# Altium schematic sheet master.SchDoc
size A4
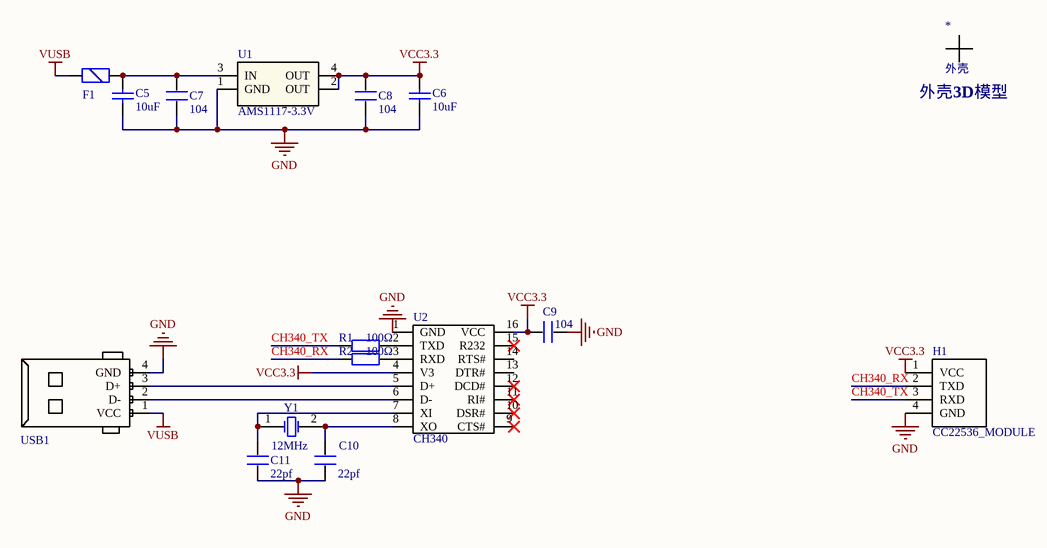
[diagram p0: master.SchDoc]

## Parts
*  外壳  [接收端外壳]
C5  10uF  [0805_C]
C6  10uF  [0805_C]
C7  104  [0603_C]
C8  104  [0603_C]
C9  104  [0603_C]
C10  22pf  [0603_C]
C11  22pf  [0603_C]
F1  F1  [Fuse1210]  (value not drawn)
H1  CC22536_MODULE  [HDR1X4]
R1  100Ω  [0603_R]
R2  100Ω  [0603_R]
U1  AMS1117-3.3V  [AMS1117_S0T89]
U2  CH340  [SOP16]
USB1  USB  [USB-211]  (value not drawn)
Y1  12MHz  [XTAL-49/S_N]

## Nets
GND: C5.1 C6.1 C7.2 C8.2 C9.1 C10.2 C11.1 H1.4(GND) U1.1(GND) U2.1(GND) USB1.4(GND)
VCC3.3: C6.2 C8.1 C9.2 H1.1(VCC) U1.2(OUT) U1.4(OUT) U2.4(V3) U2.16(VCC)
VUSB: F1.2 USB1.1(VCC)
CH340_RX: H1.2(TXD) R2.2
CH340_TX: H1.3(RXD) R1.2
NetC5_2: C5.2 C7.1 F1.1 U1.3(IN)
NetC10_1: C10.1 U2.8(XO) Y1.2(OSC2)
NetC11_2: C11.2 U2.7(XI) Y1.1(OSC1)
NetR1_1: R1.1 U2.2(TXD)
NetR2_1: R2.1 U2.3(RXD)
NetU2_5: U2.5(D+) USB1.3(D+)
NetU2_6: U2.6(D-) USB1.2(D-)

Not connected (* = marked no-connect by the designer): U2 9(CTS#)* 10(DSR#)* 11(RI#)* 12(DCD#)* 13(DTR#) 14(RTS#) 15(R232)*

## Notes on the sheet
- (near *) 外壳3D模型

## Library data of the parts
C5 C6 = 0805 2.2uF (225) 20% 50V: 贴片电容; ComponentLink1Description: 供应商链接; ComponentLink1URL: http://www.szlcsc.com/product/details_50225.html; Package: 0805; Supplier: LC; SuppliersPartNumber: C49217
C7-C11 = C
F1 = Fuse
R1 R2 = 0603 1.1KΩ (1101) 1%: 贴片电阻; ComponentLink1Description: 供应商链接; ComponentLink1URL: http://www.szlcsc.com/product/details_23491.html; Package: 0603; Supplier: LC; SuppliersPartNumber: C22764
U1 = AMS1117
USB1 = USB公头A
Y1 = XTAL: Crystal Oscillator; Published: 8-Jun-2000; LatestRevisionDate: 17-Jul-2002; LatestRevisionNote: Re-released for DXP Platform.; Publisher: Altium Limited